# EAGLE design covert2npnGNDPLANES (EAGLE 9.6.2)
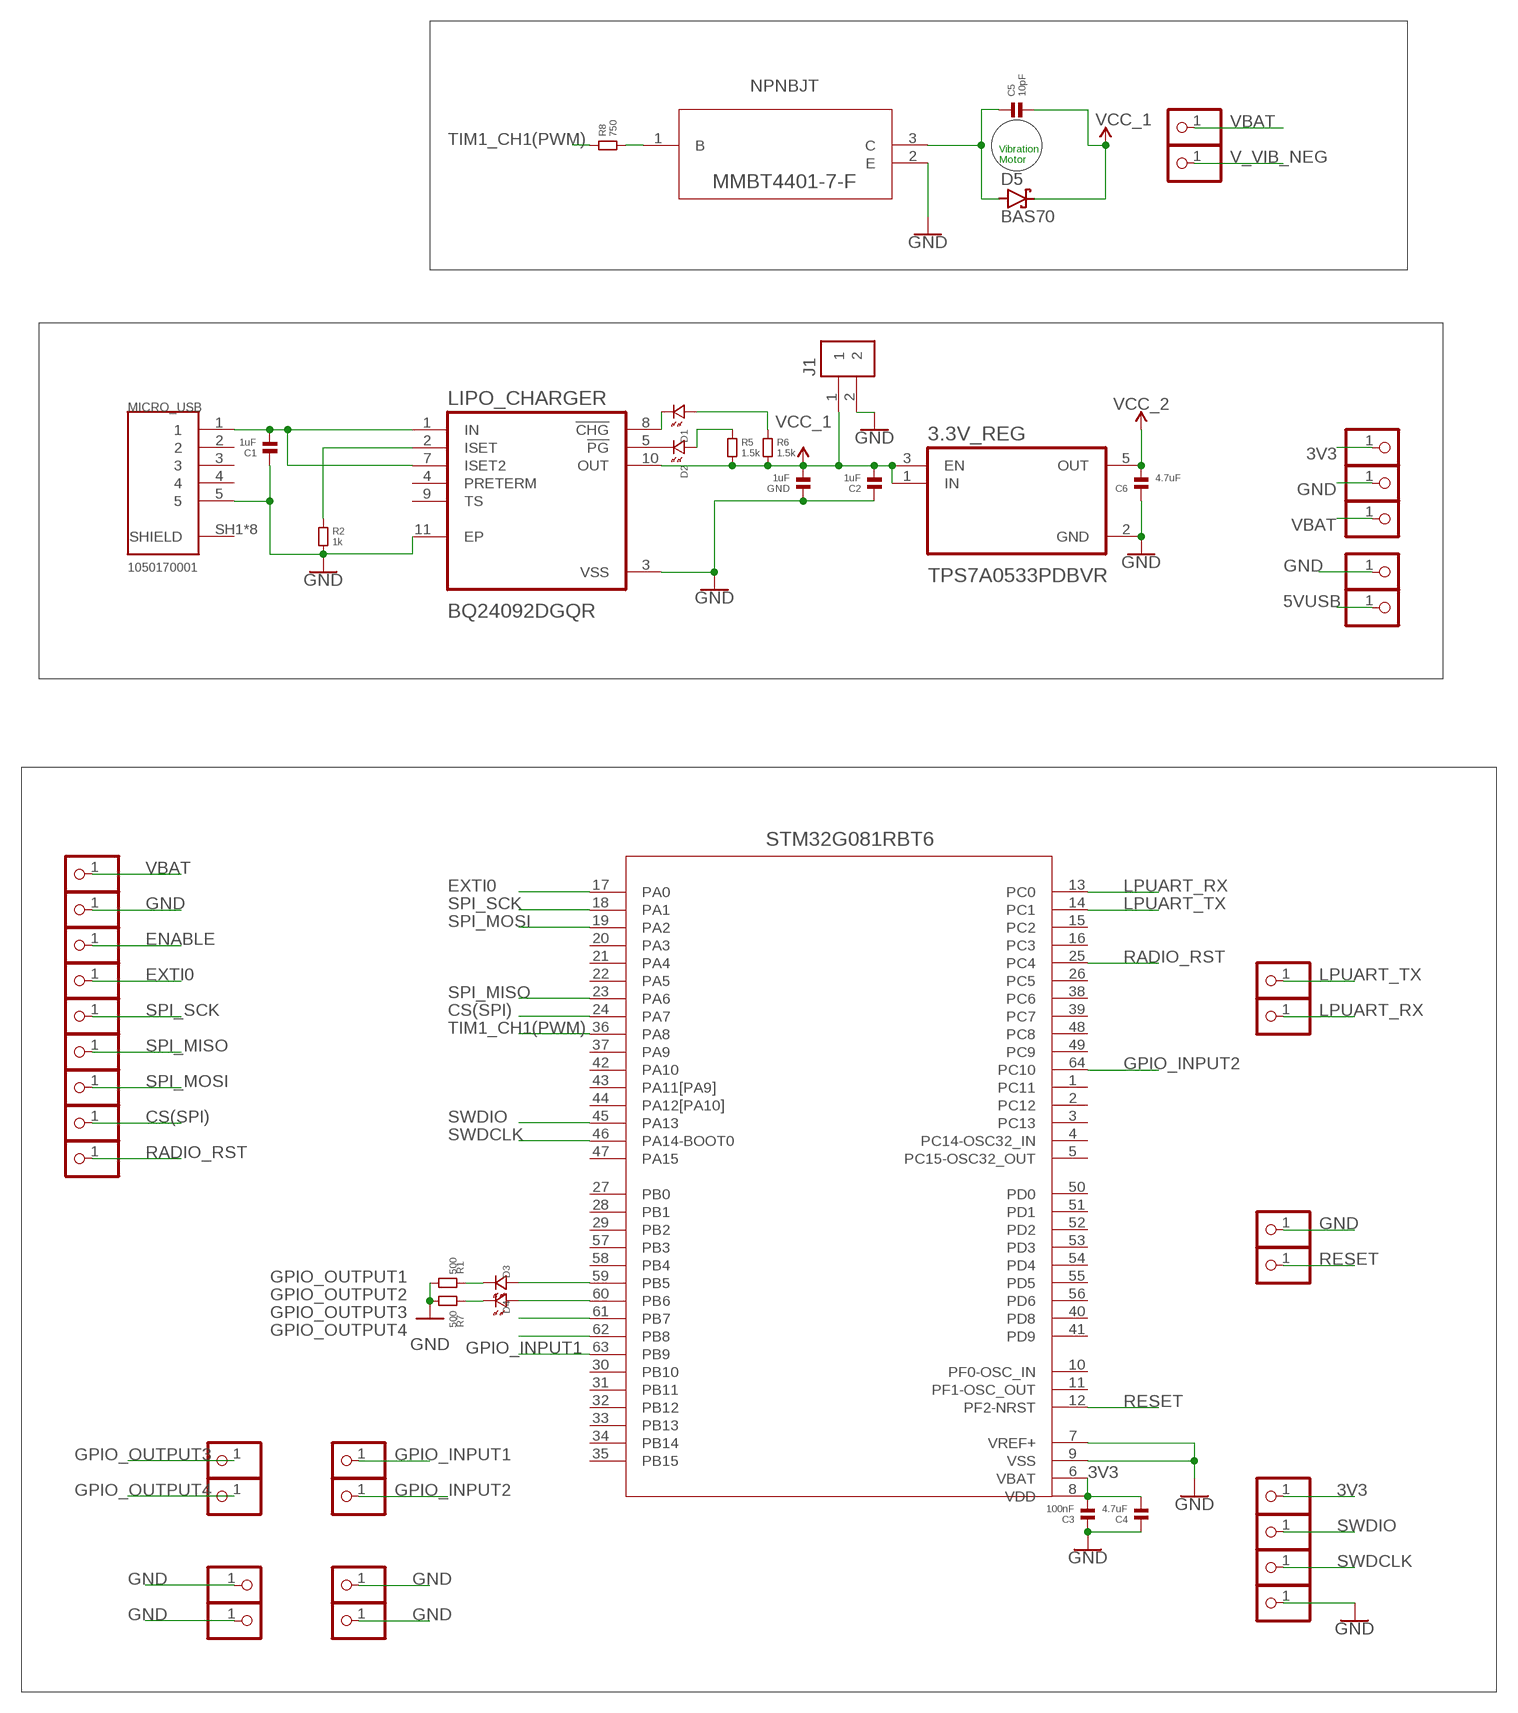
[diagram p0: schematic, sheet 1]

## Parts
3.3V_REG  TPS7A0533PDBVR  [SOT95P280X145-5N]
C1  1uF  CAPACITOR.0805  [0805]
C2  1uF  CAPACITOR.0805  [0805]
C3  100nF  CAPACITOR.0805  [0805]
C4  4.7uF  CAPACITOR.0805  [0805]
C5  10pF  CAPACITOR.0805  [0805]
C6  4.7uF  CAPACITOR.0805  [0805]
D1  LED.0805  [0805.LED]
D2  LED.0805  [0805.LED]
D3  LED.0805  [0805.LED]
D4  LED.0805  [0805.LED]
D5  BAS70  [SOT23]
GND  1uF  CAPACITOR.0805  [0805]
J1  B2B-PH-K-S(LF)(SN)  [JST_B2B-PH-K-S(LF)(SN)]
JP1  PINHD-1X1  [1X01]
JP2  PINHD-1X1  [1X01]
JP3  PINHD-1X1  [1X01]
JP4  PINHD-1X1  [1X01]
JP5  PINHD-1X1  [1X01]
JP6  PINHD-1X1  [1X01]
JP7  PINHD-1X1  [1X01]
JP8  PINHD-1X1  [1X01]
JP9  PINHD-1X1  [1X01]
JP10  PINHD-1X1  [1X01]
JP11  PINHD-1X1  [1X01]
JP12  PINHD-1X1  [1X01]
JP13  PINHD-1X1  [1X01]
JP14  PINHD-1X1  [1X01]
JP15  PINHD-1X1  [1X01]
JP16  PINHD-1X1  [1X01]
JP17  PINHD-1X1  [1X01]
JP18  PINHD-1X1  [1X01]
JP19  PINHD-1X1  [1X01]
JP20  PINHD-1X1  [1X01]
JP21  PINHD-1X1  [1X01]
JP22  PINHD-1X1  [1X01]
JP23  PINHD-1X1  [1X01]
JP24  PINHD-1X1  [1X01]
JP26  PINHD-1X1  [1X01]
JP27  PINHD-1X1  [1X01]
JP28  PINHD-1X1  [1X01]
JP29  PINHD-1X1  [1X01]
JP30  PINHD-1X1  [1X01]
JP31  PINHD-1X1  [1X01]
JP32  PINHD-1X1  [1X01]
JP33  PINHD-1X1  [1X01]
LIPO_CHARGER  BQ24092DGQR  [IC_XTR111AIDGQR]
MICRO_USB  1050170001  [MOLEX_1050170001]
R1  500  RESISTOR.0805  [0805]
R2  1k  RESISTOR.0805  [0805]
R5  1.5k  RESISTOR.0805  [0805]
R6  1.5k  RESISTOR.0805  [0805]
R7  500  RESISTOR.0805  [0805]
R8  750  RESISTOR.0805  [0805]
U1  STM32G081RBT6  [LQFP-64]
U2  MMBT4401-7-F  [SOT-23_DIO]

## Nets
3V3: 3.3V_REG.5(OUT) C3.2 C4.2 C6.2 JP4.1 JP16.1 U1.6(VBAT) U1.8(VDD) ; supply symbol labelled VCC_2
5VUSB: C1.2 JP30.1 LIPO_CHARGER.1(IN) LIPO_CHARGER.7(ISET2) MICRO_USB.1
CS(SPI): JP6.1 U1.24(PA7)
ENABLE: JP11.1
EXTI0: JP10.1 U1.17(PA0)
GND: 3.3V_REG.2(GND) C1.1 C2.1 C3.1 C4.1 C6.1 GND.1 J1.2 JP3.1 JP12.1 JP15.1 JP23.1 JP26.1 JP27.1 JP28.1 JP29.1 JP33.1 LIPO_CHARGER.3(VSS) LIPO_CHARGER.11(EP) MICRO_USB.5 R1.1 R2.2 R7.1 U1.7(VREF+) U1.9(VSS) U2.2(E)
GPIO_INPUT1: JP17.1 U1.63(PB9)
GPIO_INPUT2: JP18.1 U1.64(PC10)
GPIO_OUTPUT1: D3.P$1 U1.59(PB5)
GPIO_OUTPUT2: D4.P$1 U1.60(PB6)
GPIO_OUTPUT3: JP19.1 U1.61(PB7)
GPIO_OUTPUT4: JP20.1 U1.62(PB8)
LPUART_RX: JP32.1 U1.13(PC0)
LPUART_TX: JP31.1 U1.14(PC1)
N$1: LIPO_CHARGER.2(ISET) R2.1
N$4: D4.P$2 R7.2
N$5: D2.P$1 R5.1
N$6: D1.P$1 R6.1
N$7: D2.P$2 LIPO_CHARGER.5(!PG)
N$8: R8.2 U2.1(B)
N$9: D3.P$2 R1.2
N$11: D1.P$2 LIPO_CHARGER.8(!CHG)
RADIO_RST: JP5.1 U1.25(PC4)
RESET: JP24.1 U1.12(PF2-NRST)
SPI_MISO: JP8.1 U1.23(PA6)
SPI_MOSI: JP7.1 U1.19(PA2)
SPI_SCK: JP9.1 U1.18(PA1)
SWDCLK: JP2.1 U1.46(PA14-BOOT0)
SWDIO: JP1.1 U1.45(PA13)
TIM1_CH1(PWM): R8.1 U1.36(PA8)
V_VIB_NEG: C5.1 D5.1(A) JP22.1 U2.3(C)
VBAT: 3.3V_REG.1(IN) 3.3V_REG.3(EN) C2.2 C5.2 D5.3(C) GND.2 J1.1 JP13.1 JP14.1 JP21.1 LIPO_CHARGER.10(OUT) R5.2 R6.2 ; supply symbol labelled VCC_1
Unconnected: LIPO_CHARGER.4(PRETERM) LIPO_CHARGER.9(TS) MICRO_USB.2 MICRO_USB.3 MICRO_USB.4 MICRO_USB.SH1(SHIELD) MICRO_USB.SH2(SHIELD) MICRO_USB.SH3(SHIELD) MICRO_USB.SH4(SHIELD) MICRO_USB.SH5(SHIELD) MICRO_USB.SH6(SHIELD) MICRO_USB.SH7(SHIELD) MICRO_USB.SH8(SHIELD) U1.1(PC11) U1.2(PC12) U1.3(PC13) U1.4(PC14-OSC32_IN) U1.5(PC15-OSC32_OUT) U1.10(PF0-OSC_IN) U1.11(PF1-OSC_OUT) U1.15(PC2) U1.16(PC3) U1.20(PA3) U1.21(PA4) U1.22(PA5) U1.26(PC5) U1.27(PB0) U1.28(PB1) U1.29(PB2) U1.30(PB10) U1.31(PB11) U1.32(PB12) U1.33(PB13) U1.34(PB14) U1.35(PB15) U1.37(PA9) U1.38(PC6) U1.39(PC7) U1.40(PD8) U1.41(PD9) U1.42(PA10) U1.43(PA11[PA9]) U1.44(PA12[PA10]) U1.47(PA15) U1.48(PC8) U1.49(PC9) U1.50(PD0) U1.51(PD1) U1.52(PD2) U1.53(PD3) U1.54(PD4) U1.55(PD5) U1.56(PD6) U1.57(PB3) U1.58(PB4)

## Notes on the sheet
- Vibration
  Motor

## Library data of the parts
3.3V_REG = TPS7A0533PDBVR:TPS7A0533PDBVR; DESCRIPTION: 200-mA, ultra-low-IQ, high-accuracy, low-dropout voltage regulator with enable 5-SOT-23 -40 to 125; DIGI-KEY_PART_NUMBER: 296-TPS7A0533PDBVRCT-ND; MF: Texas Instruments; MP: TPS7A0533PDBVR; PACKAGE: SOT-23-5 Texas Instruments; PURCHASE-URL: https://pricing.snapeda.com/search/part/TPS7A0533PDBVR/?ref=eda
C1-C6 GND = standardparts:CAPACITOR
D1-D4 = standardparts:LED
D5 = diode:BAS70: Silicon Schottky Diodes General-purpose diode for high-speed switching
J1 = B2B-PH-K-S_LF__SN_:B2B-PH-K-S(LF)(SN): PH Series 2 Position 2 mm Pitch Through Hole Top Entry Shrouded Header; DESCRIPTION: Connector Header Through Hole 2 position 0.079 (2.00mm); DIGI-KEY_PART_NUMBER: 455-1704-ND; MF: JST Sales; MP: B2B-PH-K-S(LF)(SN); PACKAGE: None; PURCHASE-URL: https://pricing.snapeda.com/search/part/B2B-PH-K-S(LF)(SN)/?ref=eda
JP1-JP24 JP26-JP33 = pinhead:PINHD-1X1: PIN HEADER
LIPO_CHARGER = BQ24092DGQR:BQ24092DGQR; DESCRIPTION: 1-cell, 1-A, Li-ion battery charger with operation over JEITA and 10k? NTC 10-HVSSOP -40 to 150; DIGI-KEY_PART_NUMBER: 296-41204-1-ND; MF: Texas Instruments; MP: BQ24092DGQR; PACKAGE: HVSSOP-10 Texas Instruments; PURCHASE-URL: https://pricing.snapeda.com/search/part/BQ24092DGQR/?ref=eda
MICRO_USB = 1050170001:1050170001: Conn.; Data; USB; Recept.; Micro; B Type; Bottom Mount, SMT, with Solder Tabs, Lead-Free; DESCRIPTION: USB - micro B USB 2.0 Receptacle Connector 5 Position Surface Mount, Right Angle; Through Hole; DIGI-KEY_PART_NUMBER: WM1399CT-ND; MF: Molex; MP: 1050170001; PACKAGE: None; PURCHASE-URL: https://pricing.snapeda.com/search/part/1050170001/?ref=eda
R1 R2 R5-R8 = standardparts:RESISTOR
U1 = STM32G081RBT6v3:STM32G081RBT6; BUILT_BY: EMA_UL_Team; COPYRIGHT: Copyright (C) 2018 Accelerated Designs. All rights reserved; MANUFACTURER_PART_NUMBER: STM32G081RBT6; SOURCELIBRARY: Updates_to_database_2020-10-19; VENDOR: STMicroelectronics
U2 = MMBT4401-7-F:MMBT4401-7-F; BUILT_BY: EMA_UL_Team; MANUFACTURER_PART_NUMBER: MMBT4401-7-F; SOURCELIBRARY: DIODESINC_2_2015-08-18; VENDOR: Diodes Inc

## Board
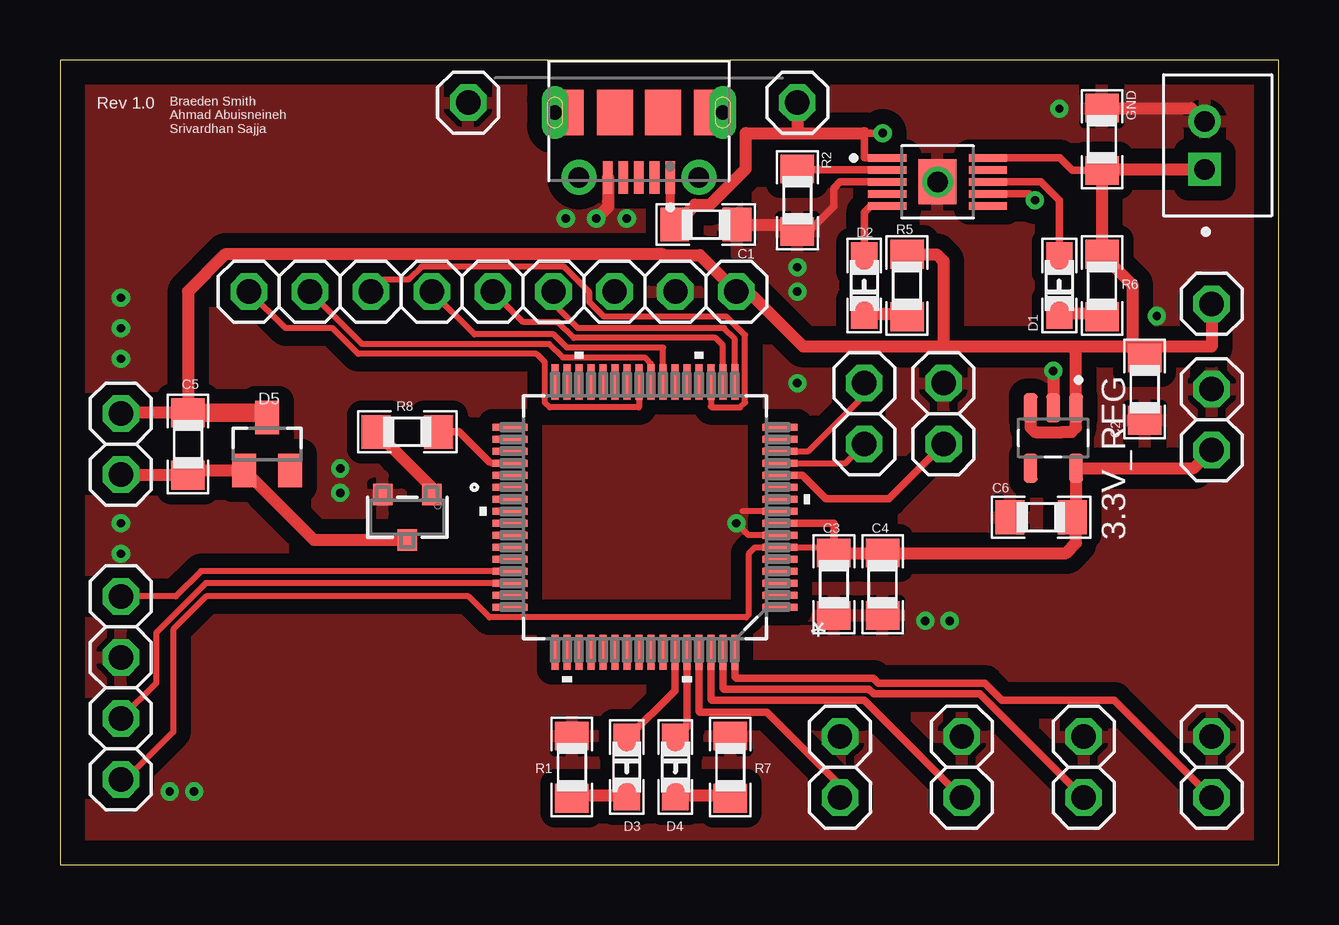
[diagram p1: board, top side]
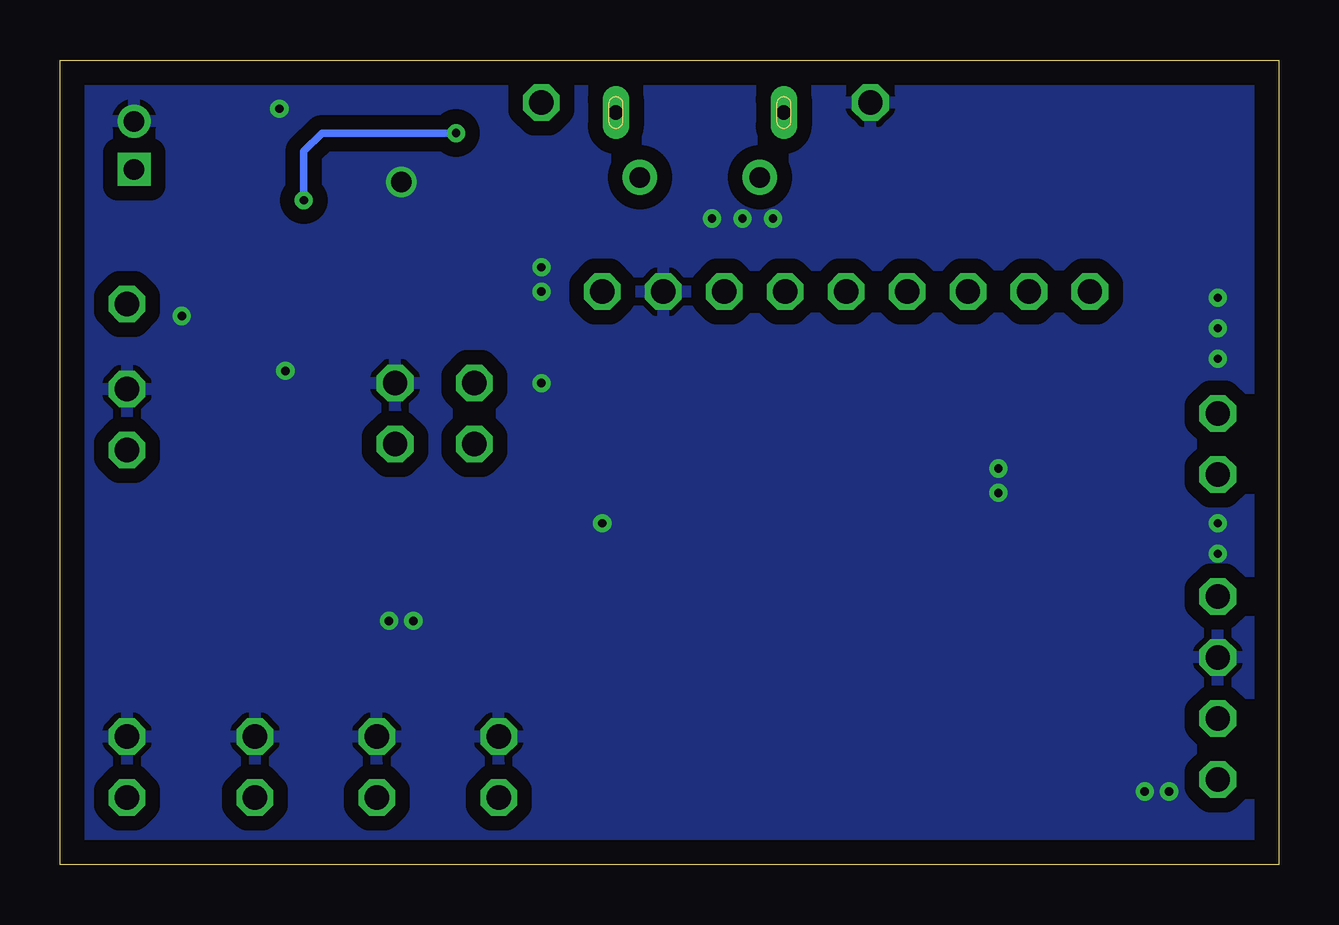
[diagram p2: board, bottom side, seen from below]

Size 50.8 x 33.53 mm. Coordinates in mm from the lower left corner, seen from the top.
Outline: 0,0 50.8,0 50.8,33.53 0,33.53 0,0
Copper layers (1*16): Top 0.035mm / dielectric 1.5mm / Bottom 0.035mm
Design rules "default": minimum track width 6mil, minimum drill 0.35mm, track to track 6mil, track to pad 6mil, pad to pad 6mil, via to via 6mil, smd to smd 6mil, copper to edge 40mil, drill to drill 6mil, minimum pad ring 10mil, minimum via ring 8mil, stop-mask expansion 4mil, vias tented up to drill 0mil, thermal gap 10mil

### Footprints (pad centres in the part's own frame; a part is rotated, then mirrored left to right if it is on the bottom)
SOT95P280X145-5N = smd 1.21 x 0.59: 1 -1.255,0.95; 2 -1.255,0; 3 -1.255,-0.95; 4 1.255,-0.95; 5 1.255,0.95
0805 = smd 1.2 x 1.4: 1 -1.3,0; 2 1.3,0
0805.LED = smd 1.25 x 1.1: P$1 -1.175,0; P$2 1.175,0
SOT23 = smd 1 x 1.4: 1 -0.95,-1.1; 2 0.95,-1.1; 3 0,1.1
JST_B2B-PH-K-S(LF)(SN) = drill 0.86 square: 1 1,-0.55 | drill 0.86: 2 -1,-0.55
1X01 = drill 1.016 octagon: 1 0,0
IC_XTR111AIDGQR = smd 1.6 x 0.3: 1 -2.1,1; 2 -2.1,0.5; 3 -2.1,0; 4 -2.1,-0.5; 5 -2.1,-1; 6 2.1,-1; 7 2.1,-0.5; 8 2.1,0; 9 2.1,0.5; 10 2.1,1 | smd 1.57 x 1.88: 11 0,0
MOLEX_1050170001 = smd 0.4 x 1.35: 1 -1.3,2.35; 2 -0.65,2.35; 3 0,2.35; 4 0.65,2.35; 5 1.3,2.35 | drill 0.85 pad 1.45: SH1 -2.5,2.35; SH2 2.5,2.35 | drill 0.6 pad 0.95 long: SH3 -3.5,-0.35; SH8 3.5,-0.35 | smd 1.2 x 1.9: SH4 -2.9,-0.35; SH7 2.9,-0.35 | smd 1.5 x 1.9: SH5 -1,-0.35; SH6 1,-0.35
LQFP-64 = smd 1.473 x 0.279: 1 -5.626,3.75; 2 -5.626,3.25; 3 -5.626,2.75; 4 -5.626,2.25; 5 -5.626,1.75; 6 -5.626,1.25; 7 -5.626,0.75; 8 -5.626,0.25; 9 -5.626,-0.25; 10 -5.626,-0.75; 11 -5.626,-1.25; 12 -5.626,-1.75; 13 -5.626,-2.25; 14 -5.626,-2.75; 15 -5.626,-3.25; 16 -5.626,-3.75; 33 5.626,-3.75; 34 5.626,-3.25; 35 5.626,-2.75; 36 5.626,-2.25; 37 5.626,-1.75; 38 5.626,-1.25; 39 5.626,-0.75; 40 5.626,-0.25; 41 5.626,0.25; 42 5.626,0.75; 43 5.626,1.25; 44 5.626,1.75; 45 5.626,2.25; 46 5.626,2.75; 47 5.626,3.25; 48 5.626,3.75 | smd 0.279 x 1.473: 17 -3.75,-5.626; 18 -3.25,-5.626; 19 -2.75,-5.626; 20 -2.25,-5.626; 21 -1.75,-5.626; 22 -1.25,-5.626; 23 -0.75,-5.626; 24 -0.25,-5.626; 25 0.25,-5.626; 26 0.75,-5.626; 27 1.25,-5.626; 28 1.75,-5.626; 29 2.25,-5.626; 30 2.75,-5.626; 31 3.25,-5.626; 32 3.75,-5.626; 49 3.75,5.626; 50 3.25,5.626; 51 2.75,5.626; 52 2.25,5.626; 53 1.75,5.626; 54 1.25,5.626; 55 0.75,5.626; 56 0.25,5.626; 57 -0.25,5.626; 58 -0.75,5.626; 59 -1.25,5.626; 60 -1.75,5.626; 61 -2.25,5.626; 62 -2.75,5.626; 63 -3.25,5.626; 64 -3.75,5.626
SOT-23_DIO = smd 0.813 x 0.889: 1 -1.025,-0.945; 2 1.025,-0.945; 3 0,0.945

### Placement (x,y rotation side)
3.3V_REG  41.4,17.78 270 top
C1  26.92,26.67 180 top
C2  45.21,19.81 90 top
C3  32.26,11.68 90 top
C4  34.29,11.68 90 top
C5  5.33,17.53 90 top
C6  40.89,14.48 0 top
D1  41.66,24.13 90 top
D2  33.53,24.13 90 top
D3  23.62,4.06 270 top
D4  25.65,4.06 270 top
D5  8.64,17.53 0 top
GND  43.43,30.23 270 top
J1  48.26,29.97 270 top
JP1  2.54,11.18 0 top
JP2  2.54,6.1 0 top
JP3  2.54,8.64 0 top
JP4  2.54,3.56 0 top
JP5  7.87,23.88 0 top
JP6  10.41,23.88 0 top
JP7  12.95,23.88 0 top
JP8  15.49,23.88 0 top
JP9  18.03,23.88 0 top
JP10  20.57,23.88 0 top
JP11  23.11,23.88 0 top
JP12  25.65,23.88 0 top
JP13  28.19,23.88 0 top
JP14  48.01,23.37 0 top
JP15  48.01,19.81 0 top
JP16  48.01,17.27 0 top
JP17  42.67,2.79 0 top
JP18  48.01,2.79 0 top
JP19  32.51,2.79 0 top
JP20  37.59,2.79 0 top
JP21  2.54,18.8 0 top
JP22  2.54,16.26 0 top
JP23  36.83,20.07 0 top
JP24  36.83,17.53 0 top
JP26  48.01,5.33 0 top
JP27  42.67,5.33 0 top
JP28  37.59,5.33 0 top
JP29  32.51,5.33 0 top
JP30  30.73,31.75 0 top
JP31  33.53,20.07 0 top
JP32  33.53,17.53 0 top
JP33  17.02,31.75 0 top
LIPO_CHARGER  36.58,28.45 0 top
MICRO_USB  24.13,30.99 180 top
R1  21.34,4.06 270 top
R2  30.73,27.69 270 top
R5  35.31,24.13 90 top
R6  43.43,24.13 90 top
R7  27.94,4.06 270 top
R8  14.48,18.03 180 top
U1  24.38,14.48 180 top
U2  14.48,14.48 180 top

### Tracks (layer width: path | path; a pad name or v marks a point on that pad's centre or on a via)
3V3
  Top 0.254: C3.2 32.01,13.23 U1.6 29.99,13.21 28.96,13.21 28.7,12.95 28.7,10.41 28.6,10.31 17.91,10.31 17.04,11.18 6.1,11.18 4.72,9.8 4.72,5.54 2.74,3.56 JP4.1
  Top 0.305: U1.8 32.25,14.23 32.26,14.22 C3.2
  Top 0.508: C3.2 C4.2 41.94,12.98 42.35,13.4 42.35,14.64 | JP16.1 47.26,16.52 3.3V_REG.5 42.35,14.64 | 42.35,14.64 C6.2
5VUSB  (via drill 0.35)
  Top 0.305: LIPO_CHARGER.1 34.46,29.46 33.53,29.46 33.53,30.48 v34.29,30.48 | LIPO_CHARGER.7 40.38,27.95 v40.64,27.69
  Top 0.381: MICRO_USB.1 25.43,26.86 C1.2
  Top 0.508: C1.2 26.46,27.51 27.1,27.51 28.59,29 28.59,30.48 30.73,30.48 | 30.73,30.48 33.53,30.48 | JP30.1 30.73,30.48
  Bottom 0.305: v34.29,30.48 39.88,30.48 40.64,29.72 v40.64,27.69
CS(SPI)
  Top 0.254: JP6.1 12.6,21.69 20.41,21.69 20.96,21.13 24.38,21.13 24.63,20.88 U1.24
EXTI0
  Top 0.254: U1.17 28.13,21.9 27.69,22.35 21.59,22.35 20.57,23.37 JP10.1
GND  (via drill 0.35, 0.85)
  Top 0.254: U1.9 28.45,14.73 | U1.7 28.69,13.73 v28.19,14.22
  Top 0.305: LIPO_CHARGER.3 32.51,28.45 32.26,28.19 32.26,27.43 31.21,26.39 R2.2
  Top 0.508: GND.1 47.16,31.53 | C1.1 30.45,26.67 R2.2 | MICRO_USB.5 22.86,28.61 22.86,27.43 v22.35,26.92 | v41.4,20.57 3.3V_REG.2
  other vias: 30.73,24.89 30.73,23.88 21.08,26.92 23.62,26.92 2.54,23.62 2.54,22.35 2.54,21.08 2.54,14.22 2.54,12.95 4.57,3.05 5.59,3.05 36.07,10.16 37.08,10.16 45.72,22.86 41.66,31.5 30.73,20.07 11.68,15.49 11.68,16.51 36.58,28.45
  pour Top (isolate 0.61): 0,33.53 0,0 50.8,0 50.8,33.53
  pour Bottom (isolate 0.61): 0,33.53 0,0 50.8,0 50.8,33.53
GPIO_INPUT1
  Top 0.305: U1.63 27.63,7.37 27.69,7.32 33.72,7.32 33.92,7.11 38.35,7.11 JP17.1
GPIO_INPUT2
  Top 0.305: U1.64 28.13,7.83 28.19,7.77 33.91,7.77 34.11,7.57 38.54,7.57 39.26,6.86 43.94,6.86 JP18.1
GPIO_OUTPUT1
  Top 0.305: U1.59 25.63,7.25 D3.P$1
GPIO_OUTPUT2
  Top 0.305: U1.60 26.13,5.72 D4.P$1
GPIO_OUTPUT3
  Top 0.305: U1.61 26.63,6.39 26.67,6.35 29.46,6.35 32.51,3.3 JP19.1
GPIO_OUTPUT4
  Top 0.305: U1.62 27.13,6.9 27.18,6.86 33.53,6.86 JP20.1
LPUART_RX
  Top 0.254: U1.13 32.73,16.73 JP32.1
LPUART_TX
  Top 0.254: U1.14 31.2,17.23 33.53,19.56 JP31.1
N$1
  Top 0.305: LIPO_CHARGER.2 30.77,28.95 R2.1
N$4
  Top 0.508: R7.2 27.82,2.89 D4.P$2
N$5
  Top 0.508: D2.P$1 35.31,22.95 R5.1
N$6
  Top 0.508: R6.1 43.31,22.95 D1.P$1
N$7
  Top 0.305: LIPO_CHARGER.5 34.46,27.43 33.78,27.43 33.53,27.18 D2.P$2
N$8
  Top 0.508: R8.2 15.5,15.71 U2.1
N$9
  Top 0.508: R1.2 21.46,2.89 D3.P$2
N$11
  Top 0.305: LIPO_CHARGER.8 40.89,28.45 41.66,27.69 D1.P$2
RADIO_RST
  Top 0.254: JP5.1 9.4,22.35 11.36,22.35 12.43,21.29 19.86,21.29 20.21,20.93 20.21,19.25 20.42,19.05 24.13,19.05 U1.25
RESET
  Top 0.305: JP24.1 34.54,15.24 31.93,15.24 30.94,16.23 U1.12
SPI_MISO
  Top 0.254: U1.23 25.13,21.53 25.15,21.54 21.13,21.54 20.57,22.1 17.27,22.1 JP8.1
SPI_MOSI
  Top 0.254: JP7.1 13.46,24.38 14.53,24.38 15.06,24.92 21,24.92 22.07,23.85 22.07,23.45 22.68,22.84 27.78,22.84 28.55,22.06 28.55,19.25 28.35,19.05 27.18,19.05 27.13,19.09 U1.19
SPI_SCK
  Top 0.254: U1.18 27.63,21.64 27.33,21.95 21.42,21.95 20.76,22.61 19.3,22.61 JP9.1
SWDCLK
  Top 0.254: JP2.1 4.01,7.57 4.01,9.67 | U1.46 6.07,11.73 4.01,9.67 | 4.01,9.67
SWDIO
  Top 0.254: U1.45 5.88,12.23 4.83,11.18 JP1.1
TIM1_CH1(PWM)
  Top 0.254: 17.89,16.78 17.95,16.73 U1.36
  Top 0.305: R8.1 16.64,18.03 17.89,16.78
V_VIB_NEG
  Top 0.508: U2.3 10.58,13.53 D5.1 5.53,16.43 C5.1 | JP22.1 5.33,16.26
  Top 0.762: 5.33,16.26 C5.1
VBAT
  Top 0.305: LIPO_CHARGER.10 41.67,29.45 42.19,28.93 GND.2
  Top 0.508: 42.16,21.59 36.83,21.59 | 36.83,21.59 30.99,21.59 28.7,23.88 JP13.1 26.67,25.4 25.15,25.4 25.09,25.45 6.91,25.45 5.33,23.88 C5.2 2.57,18.83 JP21.1 | 45.21,21.59 48.01,21.59 JP14.1 | 45.21,21.59 44.7,21.59 | 44.7,21.59 42.16,21.59 | J1.1 43.48,28.97 GND.2 R6.2 44.7,24.16 44.7,21.59 | C2.2 45.21,21.59 | 42.16,21.59 42.35,21.4 3.3V_REG.1 | R5.2 36.55,25.43 36.83,25.15 36.83,21.59 | 42.35,18.73 3.3V_REG.1 | 40.45,18.73 3.3V_REG.3 40.45,18.22 40.65,18.02 41.78,18.02 41.79,18.03 42.16,18.03 42.35,18.22 3.3V_REG.1
  Top 0.762: C5.2 8.44,18.83 D5.3

### Text on the board
tSilk: Rev 1.0 | Braeden Smith / Ahmad Abuisneineh / Srivardhan Sajja